# EAGLE design mx4660-cape (EAGLE 7.5.0)
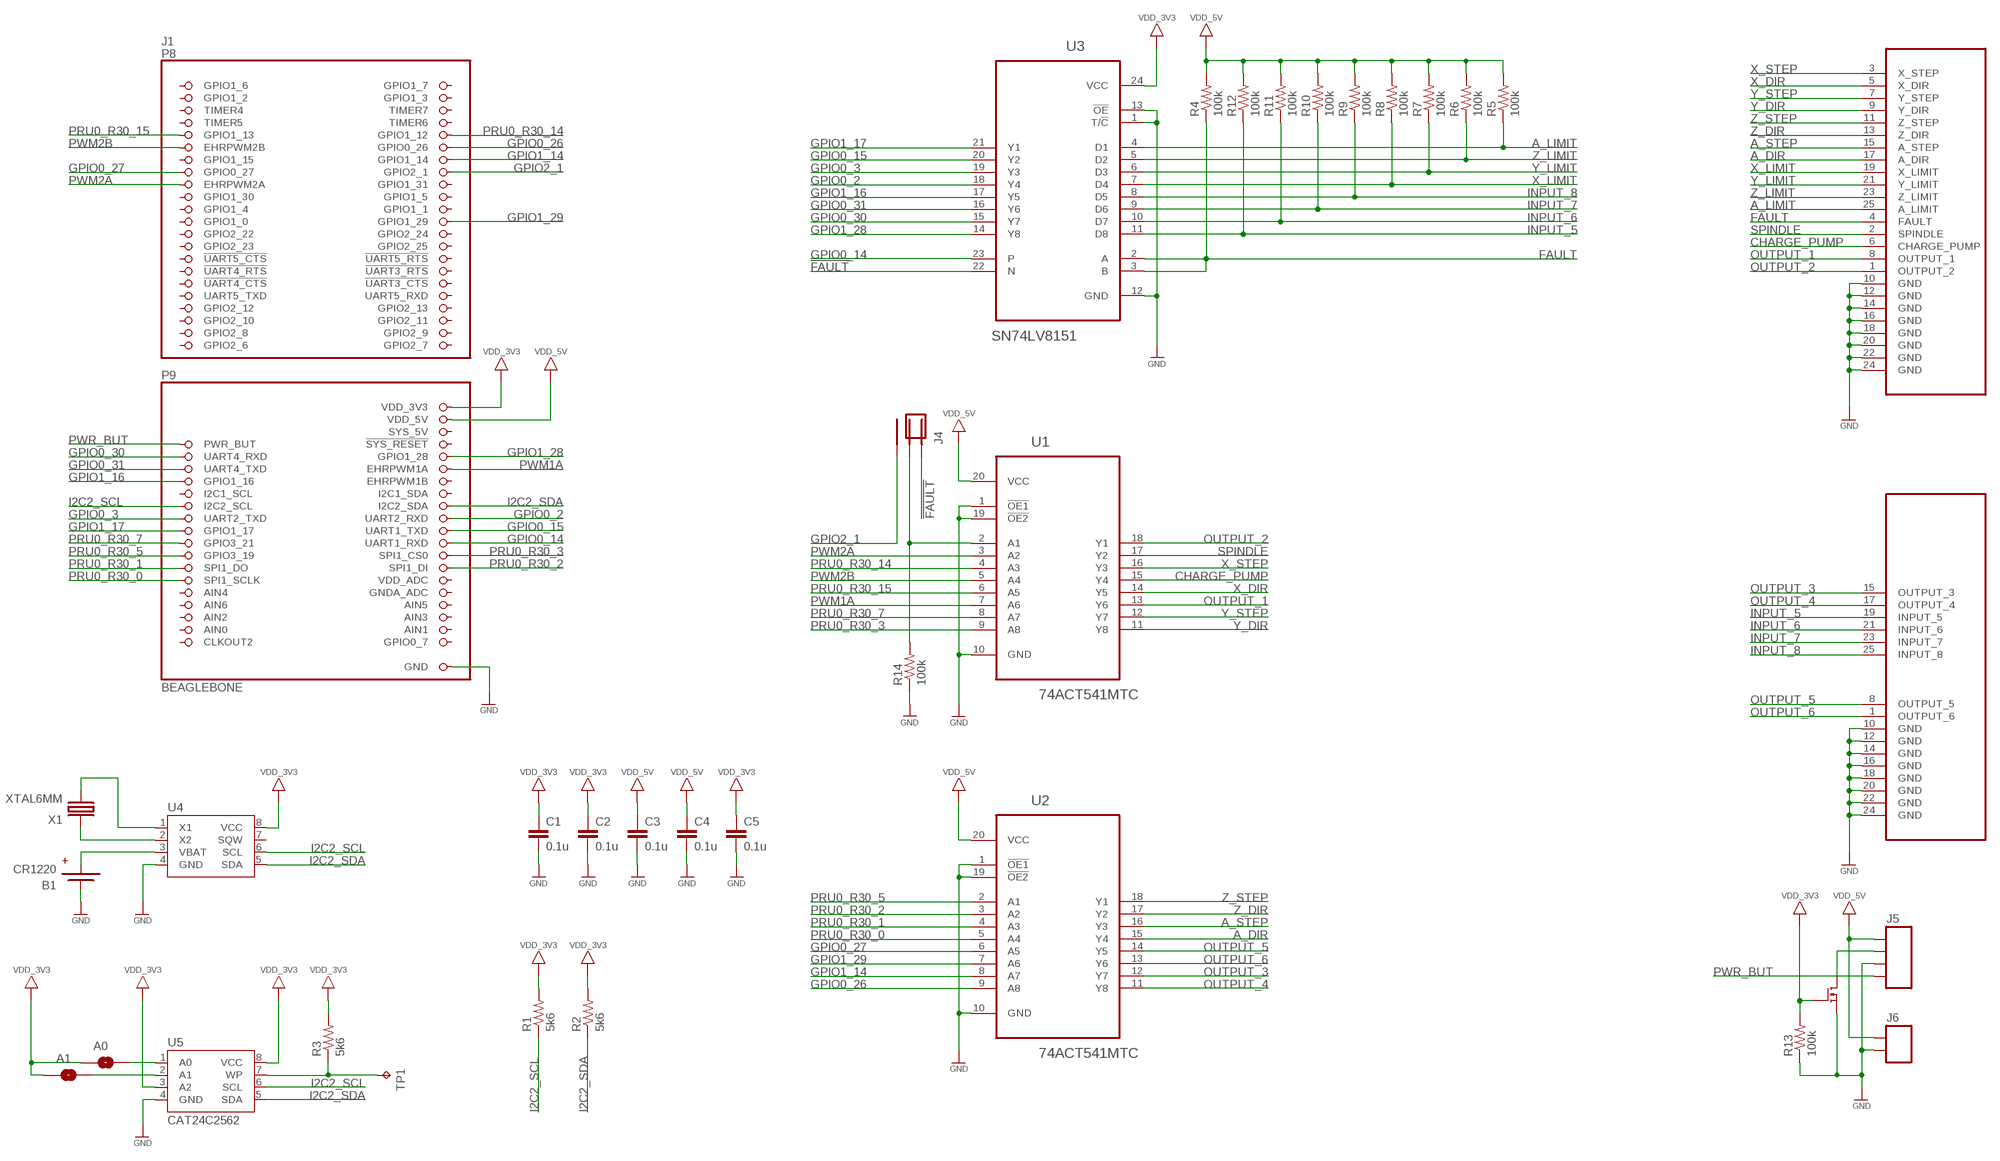
[diagram p0: schematic, sheet 1]

## Parts
A0  SOLDERJUMPERNO  [SJ_2S-NO]
A1  SOLDERJUMPERNO  [SJ_2S-NO]
B1  CR1220  CR1220SMD  [3000]
C1  0.1u  CAP  [0805]
C2  0.1u  CAP  [0805]
C3  0.1u  CAP  [0805]
C4  0.1u  CAP  [0805]
C5  0.1u  CAP  [0805]
J1  BEAGLEBONE  [BEAGLEBONE]
J2  MX4660-CN1  [HEADER-26-RA]
J3  MX4660-CN10  [HEADER-26-RA]
J4  JUMPER-3P  [JUMPER-3P]
J5  TERMINAL-4P3.5MM  [TERMINAL-4P-3.5MM]
J6  TERMINAL-2P-3.5MM  [TERMINAL-2P-3.5MM]
R1  5k6  RESISTOR  [0805]
R2  5k6  RESISTOR  [0805]
R3  5k6  RESISTOR  [0805]
R4  100k  RESISTOR  [0805]
R5  100k  RESISTOR  [0805]
R6  100k  RESISTOR  [0805]
R7  100k  RESISTOR  [0805]
R8  100k  RESISTOR  [0805]
R9  100k  RESISTOR  [0805]
R10  100k  RESISTOR  [0805]
R11  100k  RESISTOR  [0805]
R12  100k  RESISTOR  [0805]
R13  100k  RESISTOR  [0805]
R14  100k  RESISTOR  [0805]
TP1  TPB1,27  [B1,27]
U1  74ACT541MTC  [TSSOP-20]
U2  74ACT541MTC  [TSSOP-20]
U3  SN74LV8151  [TSSOP-24]
U4  RTC-DS  [SOIC-8-2]
U5  CAT24C2562  [SOIC-8-2]
U$36  BSS138  [SOT23]
X1  XTAL6MM  [XTAL-6MM]

## Nets
!FAULT: J4.1 U3.22(N)
A0: A0.2 U5.1(A0)
A1: A1.2 U5.2(A1)
A_DIR: J2.17(A_DIR) U2.15(Y4)
A_LIMIT: J2.25(A_LIMIT) R5.1 U3.4(D1)
A_STEP: J2.15(A_STEP) U2.16(Y3)
CHARGE_PUMP: J2.6(CHARGE_PUMP) U1.15(Y4)
FAULT: J2.4(FAULT) R4.1 U3.2(A) U3.3(B)
GND: B1.NEGATIVE C1.2 C2.2 C3.2 C4.2 C5.2 J1.1(GND) J1.2(GND) J1.47(GND) J1.48(GND) J1.89(GND) J1.90(GND) J1.91(GND) J1.92(GND) J2.10(GND) J2.12(GND) J2.14(GND) J2.16(GND) J2.18(GND) J2.20(GND) J2.22(GND) J2.24(GND) J3.10(GND) J3.12(GND) J3.14(GND) J3.16(GND) J3.18(GND) J3.20(GND) J3.22(GND) J3.24(GND) J5.P$2 J6.P$1 R13.1 R14.1 U1.1(!OE1) U1.10(GND) U1.19(!OE2) U2.1(!OE1) U2.10(GND) U2.19(!OE2) U3.1(T/!C) U3.12(GND) U3.13(!OE) U4.4(GND) U5.4(GND) U$36.P$2
GPIO0_2: J1.68(UART2_RXD) U3.18(Y4)
GPIO0_3: J1.67(UART2_TXD) U3.19(Y3)
GPIO0_14: J1.72(UART1_RXD) U3.23(P)
GPIO0_15: J1.70(UART1_TXD) U3.20(Y2)
GPIO0_26: J1.14(GPIO0_26) U2.9(A8)
GPIO0_27: J1.17(GPIO0_27) U2.6(A5)
GPIO0_30: J1.57(UART4_RXD) U3.15(Y7)
GPIO0_31: J1.59(UART4_TXD) U3.16(Y6)
GPIO1_14: J1.16(GPIO1_14) U2.8(A7)
GPIO1_16: J1.61(GPIO1_16) U3.17(Y5)
GPIO1_17: J1.69(GPIO1_17) U3.21(Y1)
GPIO1_28: J1.58(GPIO1_28) U3.14(Y8)
GPIO1_29: J1.26(GPIO1_29) U2.7(A6)
GPIO2_1: J1.18(GPIO2_1) J4.3
I2C2_SCL: J1.65(I2C2_SCL) R1.1 U4.6(SCL) U5.6(SCL)
I2C2_SDA: J1.66(I2C2_SDA) R2.1 U4.5(SDA) U5.5(SDA)
INPUT_5: J3.19(INPUT_5) R12.1 U3.11(D8)
INPUT_6: J3.21(INPUT_6) R11.1 U3.10(D7)
INPUT_7: J3.23(INPUT_7) R10.1 U3.9(D6)
INPUT_8: J3.25(INPUT_8) R9.1 U3.8(D5)
LED: J5.P$3 U$36.P$3
N$10: J4.2 R14.2 U1.2(A1)
N$24: U4.2(X2) X1.1
N$26: U4.1(X1) X1.2
OUTPUT_1: J2.8(OUTPUT_1) U1.13(Y6)
OUTPUT_2: J2.1(OUTPUT_2) U1.18(Y1)
OUTPUT_3: J3.15(OUTPUT_3) U2.12(Y7)
OUTPUT_4: J3.17(OUTPUT_4) U2.11(Y8)
OUTPUT_5: J3.8(OUTPUT_5) U2.14(Y5)
OUTPUT_6: J3.1(OUTPUT_6) U2.13(Y6)
PRU0_R30_0: J1.77(SPI1_SCLK) U2.5(A4)
PRU0_R30_1: J1.75(SPI1_DO) U2.4(A3)
PRU0_R30_2: J1.76(SPI1_DI) U2.3(A2)
PRU0_R30_3: J1.74(SPI1_CS0) U1.9(A8)
PRU0_R30_5: J1.73(GPIO3_19) U2.2(A1)
PRU0_R30_7: J1.71(GPIO3_21) U1.8(A7)
PRU0_R30_14: J1.12(GPIO1_12) U1.4(A3)
PRU0_R30_15: J1.11(GPIO1_13) U1.6(A5)
PWM1A: J1.60(EHRPWM1A) U1.7(A6)
PWM2A: J1.19(EHRPWM2A) U1.3(A2)
PWM2B: J1.13(EHRPWM2B) U1.5(A4)
PWR_BUT: J1.55(PWR_BUT) J5.P$1
SPINDLE: J2.2(SPINDLE) U1.17(Y2)
VBAT: B1.POSITIVE2(POSITIVE) U4.3(VBAT)
VDD_3V3: A0.1 A1.1 C1.1 C2.1 C5.1 J1.49(VDD_3V3) J1.50(VDD_3V3) R1.2 R2.2 R3.2 R13.2 U3.24(VCC) U4.8(VCC) U5.3(A2) U5.8(VCC) U$36.P$1
VDD_5V: C3.1 C4.1 J1.51(VDD_5V) J1.52(VDD_5V) J5.P$4 J6.P$2 R4.2 R5.2 R6.2 R7.2 R8.2 R9.2 R10.2 R11.2 R12.2 U1.20(VCC) U2.20(VCC)
WP: R3.1 TP1.TP U5.7(WP)
X_DIR: J2.5(X_DIR) U1.14(Y5)
X_LIMIT: J2.19(X_LIMIT) R8.1 U3.7(D4)
X_STEP: J2.3(X_STEP) U1.16(Y3)
Y_DIR: J2.9(Y_DIR) U1.11(Y8)
Y_LIMIT: J2.21(Y_LIMIT) R7.1 U3.6(D3)
Y_STEP: J2.7(Y_STEP) U1.12(Y7)
Z_DIR: J2.13(Z_DIR) U2.17(Y2)
Z_LIMIT: J2.23(Z_LIMIT) R6.1 U3.5(D2)
Z_STEP: J2.11(Z_STEP) U2.18(Y1)
Unconnected: J1.3(GPIO1_6) J1.4(GPIO1_7) J1.5(GPIO1_2) J1.6(GPIO1_3) J1.7(TIMER4) J1.8(TIMER7) J1.9(TIMER5) J1.10(TIMER6) J1.15(GPIO1_15) J1.20(GPIO1_31) J1.21(GPIO1_30) J1.22(GPIO1_5) J1.23(GPIO1_4) J1.24(GPIO1_1) J1.25(GPIO1_0) J1.27(GPIO2_22) J1.28(GPIO2_24) J1.29(GPIO2_23) J1.30(GPIO2_25) J1.31(!UART5_CTS) J1.32(!UART5_RTS) J1.33(!UART4_RTS) J1.34(!UART3_RTS) J1.35(!UART4_CTS) J1.36(!UART3_CTS) J1.37(UART5_TXD) J1.38(UART5_RXD) J1.39(GPIO2_12) J1.40(GPIO2_13) J1.41(GPIO2_10) J1.42(GPIO2_11) J1.43(GPIO2_8) J1.44(GPIO2_9) J1.45(GPIO2_6) J1.46(GPIO2_7) J1.53(SYS_5V) J1.54(SYS_5V) J1.56(!SYS_RESET) J1.62(EHRPWM1B) J1.63(I2C1_SCL) J1.64(I2C1_SDA) J1.78(VDD_ADC) J1.79(AIN4) J1.80(GNDA_ADC) J1.81(AIN6) J1.82(AIN5) J1.83(AIN2) J1.84(AIN3) J1.86(AIN1) J1.87(CLKOUT2) J1.88(GPIO0_7) U4.7(SQW)

## Power pins joined to a net without a drawn wire
AIN0: J1.85(AIN0)

## Library data of the parts
A0 A1 = mx4660-cape:SOLDERJUMPER: Solder Jumper Standard SMD solder jumper. Used to automate production. Two varients : Normally Open and Normally Closed are the same, but have different paste layers. NC will have a large amount of paste and should jumper during reflow.
B1 = mx4660-cape:CR1220
C1-C5 = mx4660-cape:CAP
J1 = mx4660-cape:BEAGLEBONE: Should match A3 pinout - but not completely tested
J2 = mx4660-cape:MX4660-CN1
J3 = mx4660-cape:MX4660-CN10
J4 = mx4660-cape:JUMPER-3P
J5 = mx4660-cape:TERMINAL-4P
J6 = mx4660-cape:TERMINAL-2P
R1-R14 = mx4660-cape:RESISTOR
TP1 = mx4660-cape:TP: Test pad
U1 U2 = mx4660-cape:74ACT541MTC: Octal Buffer/Line Driver with 3-STATE Outputs; MPN: 74ACT541MTC; OC_FARNELL: 1467294; OC_NEWARK: 78K6190; PACKAGE: TSSOP-20; SUPPLIER: FAIRCHILD
U3 = mx4660-cape:SN74LV8151
U4 = mx4660-cape:RTC-DS*
U5 = mx4660-cape:CAT24C256
U$36 = mx4660-cape:BSS138
X1 = mx4660-cape:XTAL

## Board
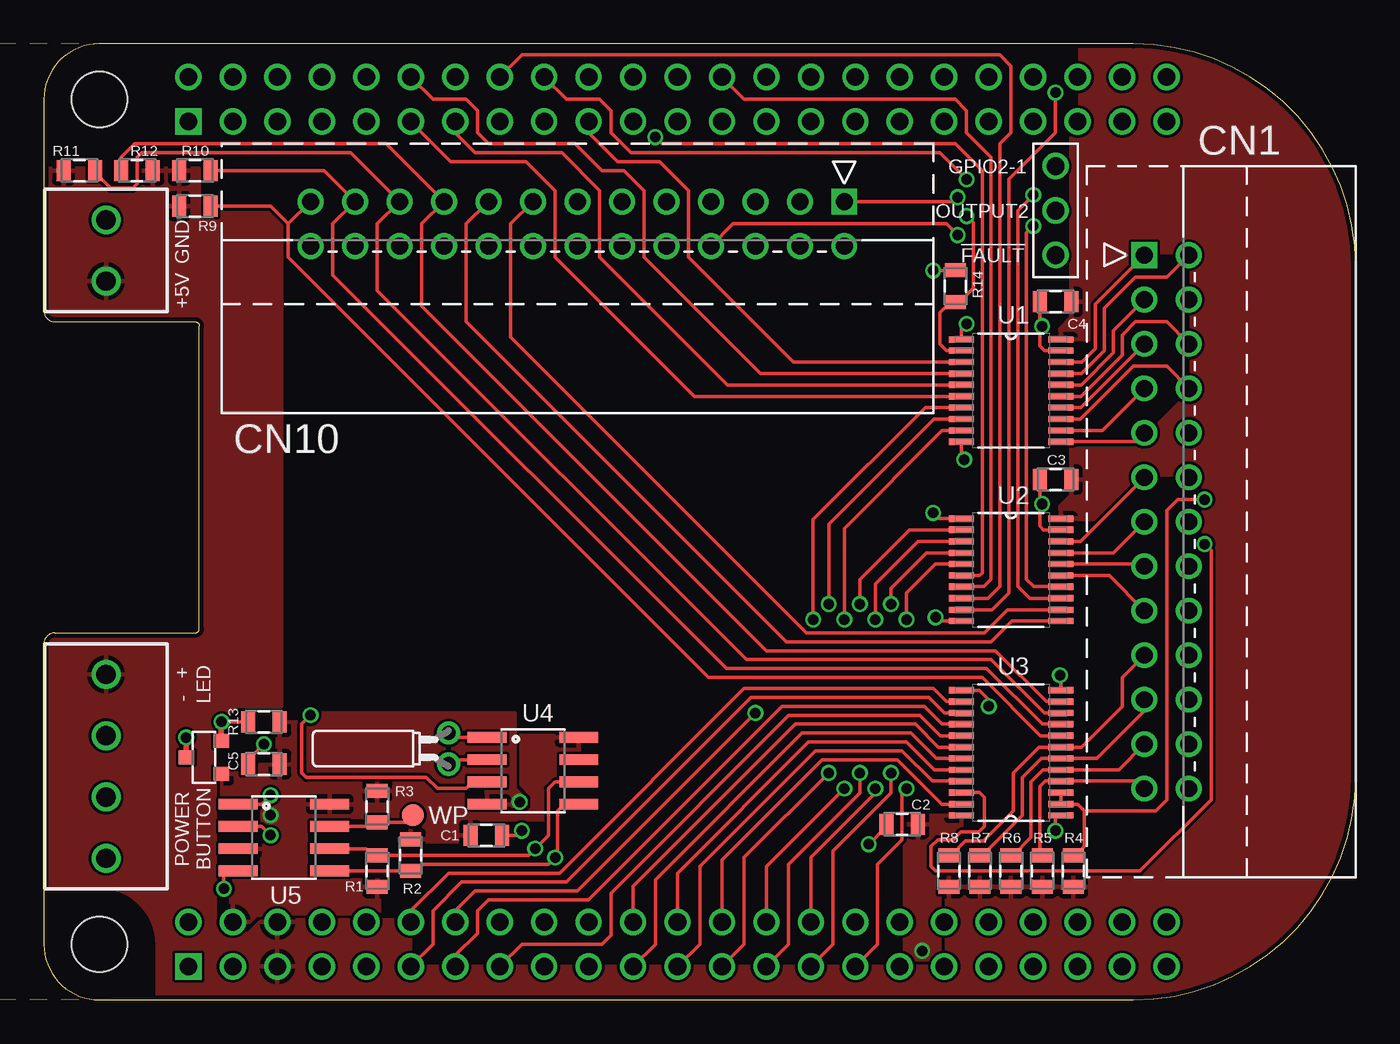
[diagram p1: board, top side]
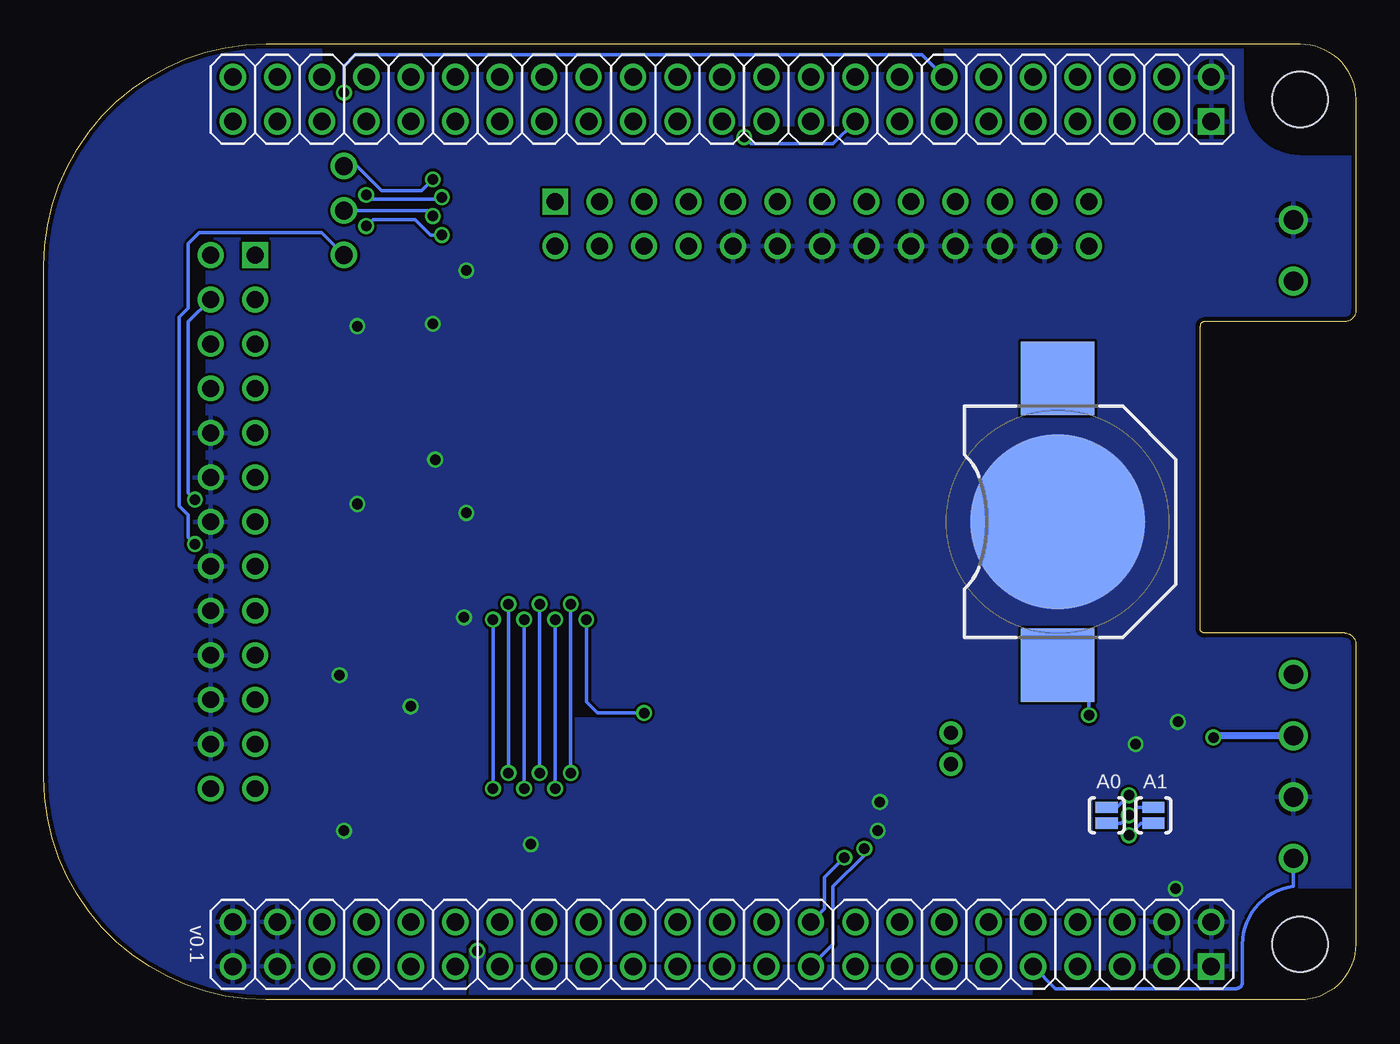
[diagram p2: board, bottom side, seen from below]

Size 74.93 x 54.61 mm. Coordinates in mm from the lower left corner, seen from the top.
Copper layers (1*16): Top 0.035mm / dielectric 1.5mm / Bottom 0.035mm
Design rules "ITead_rule *": minimum track width 6mil, minimum drill 12mil, track to track 6mil, track to pad 6mil, pad to pad 6mil, via to via 6mil, smd to smd 0mil, copper to edge 10mil, drill to drill 10mil, minimum pad ring 10mil, minimum via ring 6mil, stop-mask expansion 2mil, vias tented up to drill 100mil, thermal gap 10mil
tRestrict: 2 lines
bRestrict: 7 lines

### Footprints (pad centres in the part's own frame; a part is rotated, then mirrored left to right if it is on the bottom)
SJ_2S-NO = smd 0.635 x 1.27: 1 -0.45,0; 2 0.45,0
3000 = smd 10 x 10: NEGATIVE 0,0 | smd 4.2 x 4.2: POSITIVE1 8.185,0; POSITIVE2 -8.185,0
0805 = smd 0.8 x 1.2: 1 -0.9,0; 2 0.9,0
BEAGLEBONE = drill 1 square: 1 -50.165,19.685; 47 -1.905,19.685 | drill 1: 2 -52.705,19.685; 3 -50.165,22.225; 4 -52.705,22.225; 5 -50.165,24.765; 6 -52.705,24.765; 7 -50.165,27.305; 8 -52.705,27.305; 9 -50.165,29.845; 10 -52.705,29.845; 11 -50.165,32.385; 12 -52.705,32.385; 13 -50.165,34.925; 14 -52.705,34.925; 15 -50.165,37.465; 16 -52.705,37.465; 17 -50.165,40.005; 18 -52.705,40.005; 19 -50.165,42.545; 20 -52.705,42.545; 21 -50.165,45.085; 22 -52.705,45.085; 23 -50.165,47.625; 24 -52.705,47.625; 25 -50.165,50.165; 26 -52.705,50.165; 27 -50.165,52.705; 28 -52.705,52.705; 29 -50.165,55.245; 30 -52.705,55.245; 31 -50.165,57.785; 32 -52.705,57.785; 33 -50.165,60.325; 34 -52.705,60.325; 35 -50.165,62.865; 36 -52.705,62.865; 37 -50.165,65.405; 38 -52.705,65.405; 39 -50.165,67.945; 40 -52.705,67.945; 41 -50.165,70.485; 42 -52.705,70.485; 43 -50.165,73.025; 44 -52.705,73.025; 45 -50.165,75.565; 46 -52.705,75.565; 48 -4.445,19.685; 49 -1.905,22.225; 50 -4.445,22.225; 51 -1.905,24.765; 52 -4.445,24.765; 53 -1.905,27.305; 54 -4.445,27.305; 55 -1.905,29.845; 56 -4.445,29.845; 57 -1.905,32.385; 58 -4.445,32.385; 59 -1.905,34.925; 60 -4.445,34.925; 61 -1.905,37.465; 62 -4.445,37.465; 63 -1.905,40.005; 64 -4.445,40.005; 65 -1.905,42.545; 66 -4.445,42.545; 67 -1.905,45.085; 68 -4.445,45.085; 69 -1.905,47.625; 70 -4.445,47.625; 71 -1.905,50.165; 72 -4.445,50.165; 73 -1.905,52.705; 74 -4.445,52.705; 75 -1.905,55.245; 76 -4.445,55.245; 77 -1.905,57.785; 78 -4.445,57.785; 79 -1.905,60.325; 80 -4.445,60.325; 81 -1.905,62.865; 82 -4.445,62.865; 83 -1.905,65.405; 84 -4.445,65.405; 85 -1.905,67.945; 86 -4.445,67.945; 87 -1.905,70.485; 88 -4.445,70.485; 89 -1.905,73.025; 90 -4.445,73.025; 91 -1.905,75.565; 92 -4.445,75.565 | hole 3.175: -51.435,14.605; -3.175,14.605
HEADER-26-RA = drill 0.965 square: 1 15.24,12.065 | drill 0.965: 2 15.24,9.525; 3 12.7,12.065; 4 12.7,9.525; 5 10.16,12.065; 6 10.16,9.525; 7 7.62,12.065; 8 7.62,9.525; 9 5.08,12.065; 10 5.08,9.525; 11 2.54,12.065; 12 2.54,9.525; 13 0,12.065; 14 0,9.525; 15 -2.54,12.065; 16 -2.54,9.525; 17 -5.08,12.065; 18 -5.08,9.525; 19 -7.62,12.065; 20 -7.62,9.525; 21 -10.16,12.065; 22 -10.16,9.525; 23 -12.7,12.065; 24 -12.7,9.525; 25 -15.24,12.065; 26 -15.24,9.525
JUMPER-3P = drill 1.016: 1 -2.54,0; 2 0,0; 3 2.54,0
TERMINAL-4P-3.5MM = drill 1.1: P$1 5.25,0; P$2 1.75,0; P$3 -1.75,0; P$4 -5.25,0
TERMINAL-2P-3.5MM = drill 1.1: P$1 1.75,0; P$2 -1.75,0
B1,27 = smd 1.27 x 1.27: TP 0,0
TSSOP-20 = smd 1.422 x 0.356: 1 -2.845,2.921; 2 -2.845,2.286; 3 -2.845,1.626; 4 -2.845,0.965; 5 -2.845,0.33; 6 -2.845,-0.33; 7 -2.845,-0.965; 8 -2.845,-1.626; 9 -2.845,-2.286; 10 -2.845,-2.921; 11 2.845,-2.921; 12 2.845,-2.286; 13 2.845,-1.626; 14 2.845,-0.965; 15 2.845,-0.33; 16 2.845,0.33; 17 2.845,0.965; 18 2.845,1.626; 19 2.845,2.286; 20 2.845,2.921
TSSOP-24 = smd 1.422 x 0.356: 1 -2.845,2.921; 2 -2.845,2.286; 3 -2.845,1.626; 4 -2.845,0.965; 5 -2.845,0.33; 6 -2.845,-0.33; 7 -2.845,-0.965; 8 -2.845,-1.626; 9 -2.845,-2.286; 10 -2.845,-2.921; 11 -2.845,-3.571; 12 -2.845,-4.221; 13 2.845,-4.221; 14 2.845,-3.571; 15 2.845,-2.921; 16 2.845,-2.286; 17 2.845,-1.626; 18 2.845,-0.965; 19 2.845,-0.33; 20 2.845,0.33; 21 2.845,0.965; 22 2.845,1.626; 23 2.845,2.286; 24 2.845,2.921
SOIC-8-2 = smd 2.21 x 0.61: 1 -2.616,1.905; 2 -2.616,0.635; 3 -2.616,-0.635; 4 -2.616,-1.905; 5 2.616,-1.905; 6 2.616,-0.635; 7 2.616,0.635; 8 2.616,1.905
SOT23 = smd 0.8 x 0.9: P$1 -0.95,-1; P$2 0.95,-1; P$3 0,1
XTAL-6MM = drill 0.813: 1 -0.889,0; 2 0.889,0

### Placement (x,y rotation side)
A0  14.22,10.54 90 bottom
A1  11.56,10.54 270 bottom
B1  17.02,27.3 90 bottom
C1  25.27,9.4 0 top
C2  49.02,10.03 180 top
C3  57.79,29.72 180 top
C4  57.79,39.88 180 top
C5  12.57,13.46 180 top
J1  -11.43,0 270 top
J2  74.93,27.3 90 top
J3  30.48,33.53 0 top
J4  57.79,45.09 90 top
J5  3.56,13.34 270 top
J6  3.56,42.8 90 top
R1  19.05,7.37 270 top
R2  20.95,8.26 90 top
R3  19.05,11.05 90 top
R4  58.8,7.37 270 top
R5  57.02,7.37 270 top
R6  55.24,7.37 270 top
R7  53.47,7.37 270 top
R8  51.69,7.37 270 top
R9  8.64,45.34 180 top
R10  8.64,47.37 180 top
R11  2.03,47.37 180 top
R12  5.33,47.37 0 top
R13  12.57,15.88 0 top
R14  52.07,40.77 270 top
TP1  21.08,10.54 0 top
U1  55.24,34.8 0 top
U2  55.24,24.56 0 top
U3  55.24,13.46 180 top
U4  27.94,13.08 0 top
U5  13.72,9.27 0 top
U$36  9.14,13.84 90 top
X1  23.11,14.35 90 top

### Tracks (layer width: path | path; a pad name or v marks a point on that pad's centre or on a via)
!FAULT  (via drill 0.6)
  Top 0.203: 66.68,11.43 66.68,11.68 | 66.68,11.68 66.68,25.65 v66.29,26.04 | 66.68,11.43 66.68,11.68 | U3.22 53.44,11.84 53.72,11.56 53.72,9.91 53.4,9.59 52.39,9.59 51.94,9.14 51.05,9.14 50.67,8.76 50.67,7.62 50.93,7.37 62.61,7.37 66.68,11.43
  Bottom 0.203: J4.1 59.05,43.81 66.04,43.81 66.68,43.18 66.68,39.5 67.18,38.99 67.18,28.19 66.68,27.69 66.68,26.42 v66.29,26.04
A0  (via drill 0.6)
  Top 0.203: U5.1 12.45,11.18 v12.95,11.68
  Bottom 0.203: A0.2 13.65,10.99 v12.95,11.68
A1  (via drill 0.6)
  Top 0.203: U5.2 12.45,9.91 v12.95,9.4
  Bottom 0.203: A1.2 12.26,10.09 v12.95,9.4
A_DIR
  Top 0.203: U2.15 60.86,24.23 J2.17
A_LIMIT
  Top 0.203: J2.25 62.43,12.5 U3.4 57.2,12.5 56.9,12.19 56.9,8.39 R5.1
A_STEP
  Top 0.203: U2.16 62.74,24.89 J2.15
CHARGE_PUMP
  Top 0.203: J2.6 64.13,38.73 62.36,38.73 61.6,37.97 61.6,36.83 59.23,34.47 U1.15
FAULT  (via drill 0.6)
  Top 0.203: U3.3 U3.2 59.05,11.18 59.44,10.79 | 59.44,10.79 63.5,10.79 64.13,11.43 64.13,27.94 64.77,28.57 v66.29,28.57 | R4.1 58.94,8.27 59.44,8.76 59.44,10.79
  Bottom 0.203: J2.4 66.68,38.73 66.68,28.96 v66.29,28.57
GND  (via drill 0.6)
  Top 0.203: U2.1 51.13,27.48 v50.8,27.81 | U1.1 52.4,38.3 v52.71,38.61 | U2.19 57.1,26.85 56.9,27.05 56.9,28.19 v57.02,28.32 56.88,28.46 C3.2 | U1.19 57.15,37.08 56.9,37.34 56.9,38.35 v57.02,38.48 56.88,38.62 C4.2 | U1.10 52.4,31.04 v52.58,30.86 | C1.2 27.05,9.4 v27.3,9.65 | U5.4 10.29,7.37 v10.29,6.35 | v57.79,9.65 57.79,10.54 U3.1 | v53.98,16.76 53.98,17.14 53.44,17.68 U3.13 | U3.12 58.09,18.49 v58.04,18.54 | U2.10 51.13,21.64 v50.93,21.84 | C2.2 48.12,9.89 v47.12,8.89 | R14.1 52.06,41.66 v50.8,41.66 | C5.2 11.67,13.71 v12.57,14.61 | R13.1 v10.16,15.88
  Top 0.305: U$36.P$2 10.14,15.86 v10.16,15.88
  other vias: 27.18,11.3
  pour Bottom (rank 6): 0,0 8.64,0 8.64,1.78 10.41,1.78 10.41,0 74.93,0 74.93,54.66 0,54.66
  pour Top: 25.27,11.05 27.43,11.05 27.56,11.18 27.56,11.43 26.92,12.06 26.92,16.38 15.11,16.38 15.11,12.95 21.97,12.95 22.61,12.32 25.27,12.32
GPIO0_2
  Top 0.203: U3.18 51.1,14.43 49.78,15.75 42.93,15.75 33.66,6.48 J1.68
GPIO0_3
  Top 0.203: J1.67 34.92,3.17 34.92,6.86 43.31,15.24 49.53,15.24 50.98,13.79 U3.19
GPIO0_14
  Top 0.203: U3.23 51.31,11.18 48.77,13.72 44.45,13.72 38.73,8 J1.72
GPIO0_15
  Top 0.203: U3.20 50.88,13.13 49.28,14.73 43.69,14.73 36.2,7.24 J1.70
GPIO0_26  (via drill 0.6)
  Top 0.203: U2.9 54.15,22.28 55.12,23.24 55.12,46.86 57.79,49.53 v57.79,51.82
  Bottom 0.203: J1.14 24.77,53.98 57.15,53.98 57.79,53.34 v57.79,51.82
GPIO0_27  (via drill 0.6)
  Top 0.203: U2.6 53.44,24.23 53.59,24.38 53.59,47.37 52.07,48.9 35.31,48.9 v34.92,49.28
  Bottom 0.203: J1.17 29.84,48.9 34.54,48.9 v34.92,49.28
GPIO0_30
  Top 0.203: J1.57 22.23,3.17 22.23,5.08 23.88,6.73 29.84,6.73 40.39,17.27 50.55,17.27 51.44,16.38 U3.15
GPIO0_31
  Top 0.203: J1.59 23.49,2.54 24.77,3.81 24.77,5.08 25.4,5.71 31.12,5.71 42.16,16.76 50.29,16.76 51.31,15.75 U3.16
GPIO1_14
  Top 0.203: J1.16 27.3,53.98 54.61,53.98 55.24,53.34 55.24,49.53 54.61,48.9 54.61,23.62 53.92,22.94 U2.8
GPIO1_16
  Top 0.203: J1.61 27.3,3.17 31.88,3.17 32.38,3.68 32.38,6.1 42.55,16.26 50.04,16.26 51.21,15.09 U3.17
GPIO1_17
  Top 0.203: J1.69 37.47,3.17 37.47,7.62 44.07,14.22 49.02,14.22 50.75,12.5 U3.21
GPIO1_28
  Top 0.203: J1.58 20.95,5.08 23.11,7.24 29.46,7.24 40.01,17.78 50.8,17.78 51.55,17.03 U3.14
GPIO1_29
  Top 0.203: U2.7 53.7,23.6 54.1,24 54.1,48.13 52.71,49.53 52.71,50.8 52.07,51.44 40.01,51.44 J1.26
GPIO2_1  (via drill 0.6)
  Top 0.203: J1.18 29.84,51.44 31.75,51.44 32.38,50.8 32.38,49.53 33.53,48.39 51.18,48.39 v52.71,46.86
  Bottom 0.203: J4.3 57.02,47.62 55.63,46.23 53.34,46.23 v52.71,46.86
I2C2_SCL  (via drill 0.6)
  Top 0.203: U5.6 18.41,8.64 18.79,8.27 R1.1 27.7,8.27 v28.07,8.64 28.83,9.4 28.83,12.06 29.21,12.45 U4.6
  Bottom 0.203: J1.65 29.84,3.17 29.84,6.48 28.07,8.26 v28.07,8.64
I2C2_SDA  (via drill 0.6)
  Top 0.203: U5.5 R2.1 21.2,7.36 21.59,7.75 28.83,7.75 v29.21,8.13 29.34,8.26 29.34,10.79 29.72,11.18 U4.5
  Bottom 0.203: J1.66 30.35,5.21 30.35,6.99 v29.21,8.13
INPUT_5
  Top 0.203: U3.11 57.26,17.03 54.36,19.94 41.27,19.94 21.59,39.62 21.59,44.32 J3.19 19.88,48.58 | 19.88,48.58 19.56,48.9 | 19.56,48.9 19.88,48.58 | R12.1 4.43,48.12 5.21,48.9 19.56,48.9
INPUT_6
  Top 0.203: U3.10 57.15,16.38 54.1,19.43 40.13,19.43 19.05,40.51 19.05,44.32 J3.21 17.53,48.39 5.59,48.39 5.33,48.13 5.33,46.61 5.08,46.35 3.81,46.35 2.93,47.23 R11.1
INPUT_7
  Top 0.203: U3.9 57.02,15.75 53.85,18.92 38.99,18.92 16.51,41.4 16.51,44.32 J3.23 16,47.37 R10.1
INPUT_8
  Top 0.203: U3.8 56.92,15.09 53.59,18.41 37.97,18.41 13.97,42.42 13.97,44.32 | 13.97,44.32 J3.25 | R9.1 12.95,45.34 13.97,44.32
LED  (via drill 0.6)
  Top 0.305: v8.13,14.99 8.14,14.97 U$36.P$3
  Bottom 0.406: J5.P$3 8.03,15.09 v8.13,14.99
N$10  (via drill 0.6)
  Top 0.203: U1.2 51.56,37.08 51.18,37.47 51.18,39.24 51.8,39.87 R14.2 52.31,39.87 53.09,40.64 53.09,44.39 v52.71,44.77
  Bottom 0.203: J4.2 53.02,45.09 v52.71,44.77
N$24
  Top 0.203: U4.2 23.37,13.72 X1.1
N$26
  Top 0.203: U4.1 23.37,14.99 X1.2
OUTPUT_1
  Top 0.203: J2.8 64.13,36.2 62.23,36.2 59.21,33.17 U1.13
OUTPUT_2
  Top 0.203: U1.18 59.28,36.42 60.07,37.21 60.07,39.75 J2.1
OUTPUT_3
  Top 0.203: U2.12 55.04,22.28 53.72,20.95 43.56,20.95 26.67,37.85 26.67,44.32 J3.15
OUTPUT_4
  Top 0.203: U2.11 55.3,21.64 54.1,20.45 42.42,20.45 24.13,38.73 24.13,44.32 J3.17
OUTPUT_5  (via drill 0.6)
  Top 0.203: U2.14 56.54,23.6 56.13,24 56.13,43.81 v56.51,44.2 | J3.8 39.37,44.32 51.56,44.32 v52.2,43.69
  Bottom 0.203: v56.51,44.2 56.13,44.58 53.72,44.58 52.83,43.69 v52.2,43.69
OUTPUT_6  (via drill 0.6)
  Top 0.203: U2.13 56.31,22.94 55.63,23.62 55.63,45.09 v56.51,45.97 | v52.2,45.85 51.94,45.59 J3.1
  Bottom 0.203: v56.51,45.97 56.26,45.72 52.32,45.72 v52.2,45.85
PRU0_R30_0  (via drill 0.6)
  Top 0.203: J1.77 47.62,3.17 47.62,7.75 49.02,9.14 49.02,11.81 v49.28,12.06 | U2.5 50.93,24.89 49.28,23.24 v49.28,21.72
  Bottom 0.203: v49.28,12.06 v49.28,21.72
PRU0_R30_1  (via drill 0.6)
  Top 0.203: J1.75 45.09,3.17 45.09,8.51 48.39,11.81 v48.39,12.95 | U2.4 50.42,25.53 48.39,23.5 v48.39,22.61
  Bottom 0.203: v48.39,12.95 v48.39,22.61
PRU0_R30_2  (via drill 0.6)
  Top 0.203: U2.3 49.94,26.19 47.5,23.75 v47.5,21.72 | v47.5,12.06 47.5,11.81 43.81,8.13 J1.76
  Bottom 0.203: v47.5,12.06 v47.5,21.72
PRU0_R30_3  (via drill 0.6)
  Top 0.203: v45.72,21.72 45.72,26.92 51.31,32.51 U1.9 | v45.72,12.06 41.27,7.62 J1.74
  Bottom 0.203: v45.72,12.06 v45.72,21.72
PRU0_R30_5  (via drill 0.6)
  Top 0.203: J1.73 42.55,3.17 42.55,7.75 46.61,11.81 v46.61,12.95 | U2.2 49.45,26.85 46.61,24 v46.61,22.61
  Bottom 0.203: v46.61,12.95 v46.61,22.61
PRU0_R30_7  (via drill 0.6)
  Top 0.203: J1.71 40.01,3.17 40.01,8.13 v44.83,12.95 | U1.8 50.83,33.17 44.83,27.18 v44.83,22.61
  Bottom 0.203: v44.83,12.95 v44.83,22.61
PRU0_R30_14
  Top 0.203: J1.12 22.23,51.44 24.13,51.44 24.77,50.8 24.77,49.53 25.4,48.9 30.35,48.9 31.88,47.37 33.15,47.37 34.29,46.23 34.29,42.42 40.95,35.76 U1.4
PRU0_R30_15
  Top 0.203: U1.6 37.16,34.47 29.21,42.42 29.21,46.23 27.56,47.88 23.24,47.88 J1.11
PWM1A  (via drill 0.6)
  Top 0.203: U1.7 50.34,33.83 43.94,27.43 v43.94,21.72 | J1.60 23.49,5.08 24.64,6.22 30.48,6.22 v40.64,16.38
  Bottom 0.203: v43.94,21.72 43.94,17.02 43.31,16.38 v40.64,16.38
PWM2A
  Top 0.203: J1.19 31.12,49.53 32.77,47.88 35.18,47.88 36.83,46.23 36.83,42.42 42.82,36.42 U1.3
PWM2B
  Top 0.203: U1.5 39.04,35.13 31.75,42.42 31.75,46.23 29.59,48.39 24.64,48.39 23.49,49.53 J1.13
PWR_BUT
  Bottom 0.203: J1.55 17.14,0.64 6.86,0.64 arc-90 6.48,1.02 6.48,3.17 arc82 3.56,6.48 J5.P$1
SPINDLE
  Top 0.203: J2.2 64.13,41.27 62.36,41.27 60.58,39.5 60.58,37.08 59.26,35.76 U1.17
VBAT  (via drill 0.6)
  Top 0.203: U4.3 24.51,12.45 24.13,12.06 22.48,12.06 21.84,12.7 14.99,12.7 14.73,12.95 14.73,15.75 v15.24,16.26
  Bottom 0.203: 18.8,17.34 B1.POSITIVE2 15.24,17.34 v15.24,16.26
VDD_3V3  (via drill 0.6)
  Bottom 0.203: A1.1 12.5,10.99 v12.95,10.54 13.4,10.09 A0.1
  other vias: 50.16,2.79
  pour Top (rank 6): 12.45,8.76 12.45,11.68 10.16,11.68 10.16,12.95 12.32,12.95 12.32,13.46 13.34,13.46 13.34,15.88 14.48,15.88 14.48,15.11 30.61,15.11 30.61,14.22 29.21,14.22 29.21,10.29 24.51,10.29 24.51,9.02 20.32,9.02 20.32,10.41 14.99,10.41 14.99,6.86 19.18,6.86 19.18,4.19 10.67,4.19 10.67,7.62 12.45,7.62 12.45,8.51 10.92,8.51 10.92,8.76
  pour Top: 49.15,10.54 52.45,10.54 52.45,8.89 51.18,8.89 51.18,2.29 49.15,2.29
  pour Bottom: 10.67,4.57 10.67,1.78 18.54,1.78 18.54,0 50.55,0 50.55,2.92 50.29,3.17 50.04,3.17 49.78,2.92 49.78,1.91 20.95,1.91 20.95,4.57
VDD_5V
  pour Top (rank 2): 74.93,54.61 74.93,0 0,0 0,47.5 8.89,47.5 8.89,45.21 13.59,45.21 13.59,16.76 10.92,16.76 9.78,15.62 9.78,4.57 10.54,3.81 11.68,3.81 12.45,4.57 20.95,4.57 20.95,1.91 51.56,1.91 51.56,10.41 65.66,10.41 65.66,29.97 62.99,29.97 60.45,27.43 58.04,27.43 58.04,28.19 58.67,28.83 58.67,31.5 62.23,31.5 65.53,34.8 65.53,42.67 62.87,42.67 62.87,37.72 58.04,37.72 58.04,38.35 58.67,38.99 58.67,49.66 59.18,50.16 59.18,54.61
WP
  Top 0.203: TP1.TP 20.69,10.15 R3.1 18.81,9.91 U5.7
X_DIR
  Top 0.203: U1.14 59.23,33.83 J2.5
X_LIMIT
  Top 0.203: J2.19 61.6,18.41 61.6,16.76 59.26,14.43 U3.7 56.85,14.43 55.37,12.95 55.37,10.79 53.66,9.08 52.64,9.08 51.83,8.27 R8.1
X_STEP
  Top 0.203: U1.16 59.26,35.13 61.09,36.96 61.09,38.23 J2.3
Y_DIR
  Top 0.203: U1.11 62.36,31.88 J2.9
Y_LIMIT
  Top 0.203: J2.21 62.87,16.51 60.15,13.79 U3.6 56.97,13.79 55.88,12.7 55.88,10.54 53.6,8.27 R7.1
Y_STEP
  Top 0.203: U1.12 60.45,32.51 J2.7
Z_DIR
  Top 0.203: U2.17 61.09,25.53 J2.13
Z_LIMIT
  Top 0.203: J2.23 61.39,13.13 U3.5 57.07,13.13 56.39,12.45 56.39,9.27 55.38,8.27 R6.1
Z_STEP
  Top 0.203: U2.18 59.21,26.19 J2.11

### Text on the board
tNames: GPIO2-1 | CN1 | OUTPUT2 | GND | !FAULT | +5V | CN10 | - + / LED | POWER / BUTTON | WP
bNames: v0.1